# EAGLE design ab73287 (EAGLE 9.6.2)
Spring 2021 Spring break camp Jonathan Valvano and Daniel Valvano This PCB is meant as a starter file to implement labs associated with EE319K/EE319H For more information see http://users.ece.utexas.edu/~valvano/Volume1/ March 10, 2021
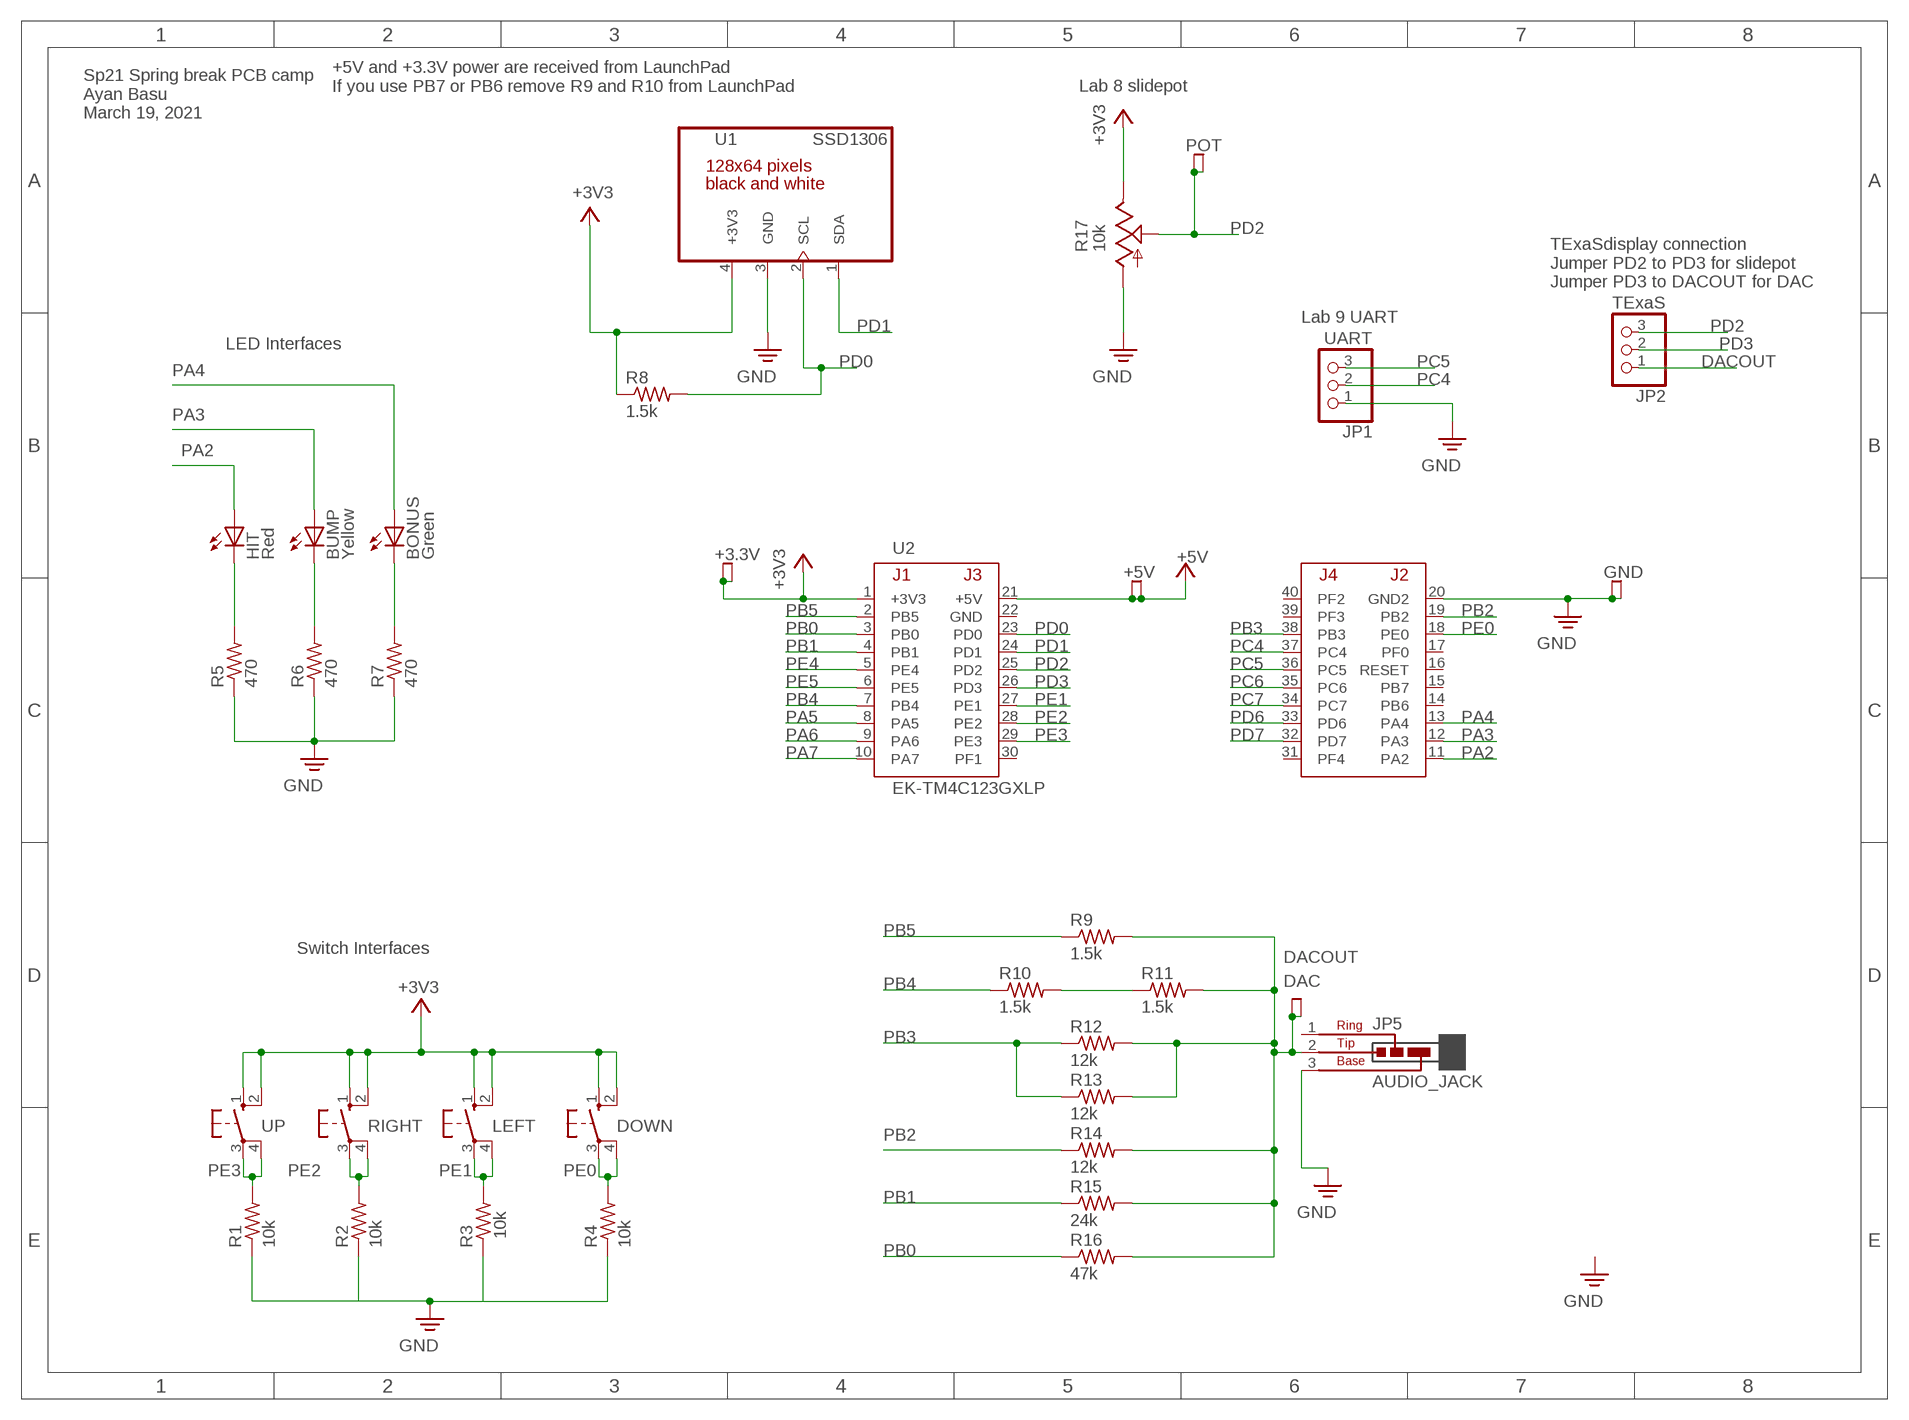
[diagram p0: schematic, sheet 1]

## Parts
+3.3V  TP2  [TP2]
+5V  TP2  [TP2]
BONUS  Green  LED5MM  [LED5MM]
BUMP  Yellow  LED5MM  [LED5MM]
DAC  TP2  [TP2]
DOWN  B3F-1052  [B3F-10XX]
GND  TP2  [TP2]
HIT  Red  LED5MM  [LED5MM]
JP1  UART  PINHD-1X3  [1X03]
JP2  TExaS  PINHD-1X3  [1X03]
JP5  AUDIO_JACK  [JACK]
LEFT  B3F-1052  [B3F-10XX]
POT  TP2  [TP2]
R1  10k  RESISTOR0204/7  [RES300MIL]
R2  10k  RESISTOR0204/7  [RES300MIL]
R3  10k  RESISTOR0204/7  [RES300MIL]
R4  10k  RESISTOR0204/7  [RES300MIL]
R5  470  RESISTOR0204/7  [RES300MIL]
R6  470  RESISTOR0204/7  [RES300MIL]
R7  470  RESISTOR0204/7  [RES300MIL]
R8  1.5k  RESISTOR0204/7  [RES300MIL]
R9  1.5k  RESISTOR0204/7  [RES300MIL]
R10  1.5k  RESISTOR0204/7  [RES300MIL]
R11  1.5k  RESISTOR0204/7  [RES300MIL]
R12  12k  RESISTOR0204/7  [RES300MIL]
R13  12k  RESISTOR0204/7  [RES300MIL]
R14  12k  RESISTOR0204/7  [RES300MIL]
R15  24k  RESISTOR0204/7  [RES300MIL]
R16  47k  RESISTOR0204/7  [RES300MIL]
R17  10k  POTENTIOMETERB25U  [B25U]
RIGHT  B3F-1052  [B3F-10XX]
U1  SSD1306  [SSD1306]
U2  EK-TM4C123GXLP  [TM4C123LAUNCHPAD]
UP  B3F-1052  [B3F-10XX]

## Nets
+3V3: +3.3V.MP1(TPB) +3.3V.MP(TPA) DOWN.1(S) DOWN.2(S1) LEFT.1(S) LEFT.2(S1) R8.1 R17.1(E) RIGHT.1(S) RIGHT.2(S1) U1.4(+3V3) U2.1(+3V3) UP.1(S) UP.2(S1)
+5V: +5V.MP1(TPB) +5V.MP(TPA) U2.21(+5V)
BIT4: R10.2 R11.1
DACOUT: DAC.MP1(TPB) DAC.MP(TPA) JP2.1 JP5.2(TIP) R9.2 R11.2 R12.2 R13.2 R14.2 R15.2 R16.2
GND: GND.MP1(TPB) GND.MP(TPA) JP1.1 JP5.3(BASE) R1.1 R2.1 R3.1 R4.1 R5.1 R6.1 R7.1 R17.3(A) U1.3(GND) U2.20(GND2)
GREEN: BONUS.K(C) R7.2
PA2: HIT.A U2.11(PA2)
PA3: BUMP.A U2.12(PA3)
PA4: BONUS.A U2.13(PA4)
PA5: U2.8(PA5)
PA6: U2.9(PA6)
PA7: U2.10(PA7)
PB0: R16.1 U2.3(PB0)
PB1: R15.1 U2.4(PB1)
PB2: R14.1 U2.19(PB2)
PB3: R12.1 R13.1 U2.38(PB3)
PB4: R10.1 U2.7(PB4)
PB5: R9.1 U2.2(PB5)
PC4: JP1.2 U2.37(PC4)
PC5: JP1.3 U2.36(PC5)
PC6: U2.35(PC6)
PC7: U2.34(PC7)
PD0: R8.2 U1.2(SCL) U2.23(PD0)
PD1: U1.1(SDA) U2.24(PD1)
PD2: JP2.3 POT.MP1(TPB) POT.MP(TPA) R17.2(S) U2.25(PD2)
PD3: JP2.2 U2.26(PD3)
PD6: U2.33(PD6)
PD7: U2.32(PD7)
PE0: DOWN.3(P) DOWN.4(P1) R4.2 U2.18(PE0)
PE1: LEFT.3(P) LEFT.4(P1) R3.2 U2.27(PE1)
PE2: R2.2 RIGHT.3(P) RIGHT.4(P1) U2.28(PE2)
PE3: R1.2 U2.29(PE3) UP.3(P) UP.4(P1)
PE4: U2.5(PE4)
PE5: U2.6(PE5)
RED: HIT.K(C) R5.2
YELLOW: BUMP.K(C) R6.2
Unconnected: JP5.1(RING) U2.14(PB6) U2.15(PB7) U2.16(RESET) U2.17(PF0) U2.22(GND) U2.30(PF1) U2.31(PF4) U2.39(PF3) U2.40(PF2)

## Notes on the sheet
- +5V and +3.3V power are received from LaunchPad
  If you use PB7 or PB6 remove R9 and R10 from LaunchPad
- Lab 8 slidepot
- Sp21 Spring break PCB camp
  Ayan Basu
  March 19, 2021
- TExaSdisplay connection
  Jumper PD2 to PD3 for slidepot
  Jumper PD3 to DACOUT for DAC
- Lab 9 UART
- LED Interfaces
- Switch Interfaces

## Library data of the parts
+3.3V +5V DAC GND POT = EE445L:TP2: Low-cost test point Made with two 0.8mm holes.
BONUS BUMP HIT = EE445L:LED: Avago Technologies LED Green 2mA 5mm diffused, HLMP-4740, Digikey 516-1327-ND Red 1.6V 1mA 5mm diffused, HLMP-D150, Digikey 516-1323-ND Yellow 2mA 5mm diffused, HLMP-4719, Digikey 516-1326-ND Orange 10mA 5mm diffused HLMP-D401, Digikey 516-1330-ND Blue 10mA 5mm diffused
DOWN LEFT RIGHT UP = EE445L:B3F-1052: OMRON SWITCH 1.1mm holes B3F tactile push button switch, Omron, B3F-1050 SW404-ND; MPN: B3F-1000; OC_FARNELL: 176432; OC_NEWARK: 36M3542
JP1 JP2 = EE445L:PINHD-1X3: PIN HEADER
JP5 = EE445L:AUDIO_JACK: Audio Jack Stereo Jack 3pin 3.5mm, CUI, SJ1-3553NG, CP1-3553NG-ND; OC_FARNELL: unknown; OC_NEWARK: unknown
R1-R16 = EE445L:RESISTOR: RESISTOR, American symbol
R17 = EE445L:POTENTIOMETER: POTENTIOMETER Warning There are many many sizes and shapes of potentiometers. Please verify both the wiring and the physical layout of your pots.
U1 = EE445L:SSD1306: Typo on OLED has a 0-ohm resistor selection that says "IIC ADDRESS SELECT 0x78 0x7A" should have said "IIC ADDRESS SELECT 0x3C 0x3D" search for I2C SSD1306 on Amazon.com https://www.amazon.com/gp/product/B0871KW7BD - VCC 3.3V power to OLED - GND ground - SCL I2C clock (add 1.5k resistor from SCL to 3.3V) - SDA I2C data * ----I2C0------ |-----I2C1 -----|-----I2C2 ------|------I2C3---- * ---------------- | ---------------- | ---------------- | ---------------- * SCL ---- PB2 | SCL --- PA6 | SCL ---- PE4 | SCL --- PD0 * SDA --- PB3 | SDA --- PA7 | SDA -- PE5 | SDA --- PD1
U2 = EE445L:EK-TM4C123GXL: Texas Instruments TM4C123 LaunchPad EK-TM4C123GXL www.ti.com/tool/ek-tm4c123gxl

## Board
Spring 2021 Spring break camp Jonathan Valvano and Daniel Valvano This PCB is meant as a starter file to implement labs associated with EE319K/EE319H For more information see http://users.ece.utexas.edu/~valvano/Volume1/ March 10, 2021
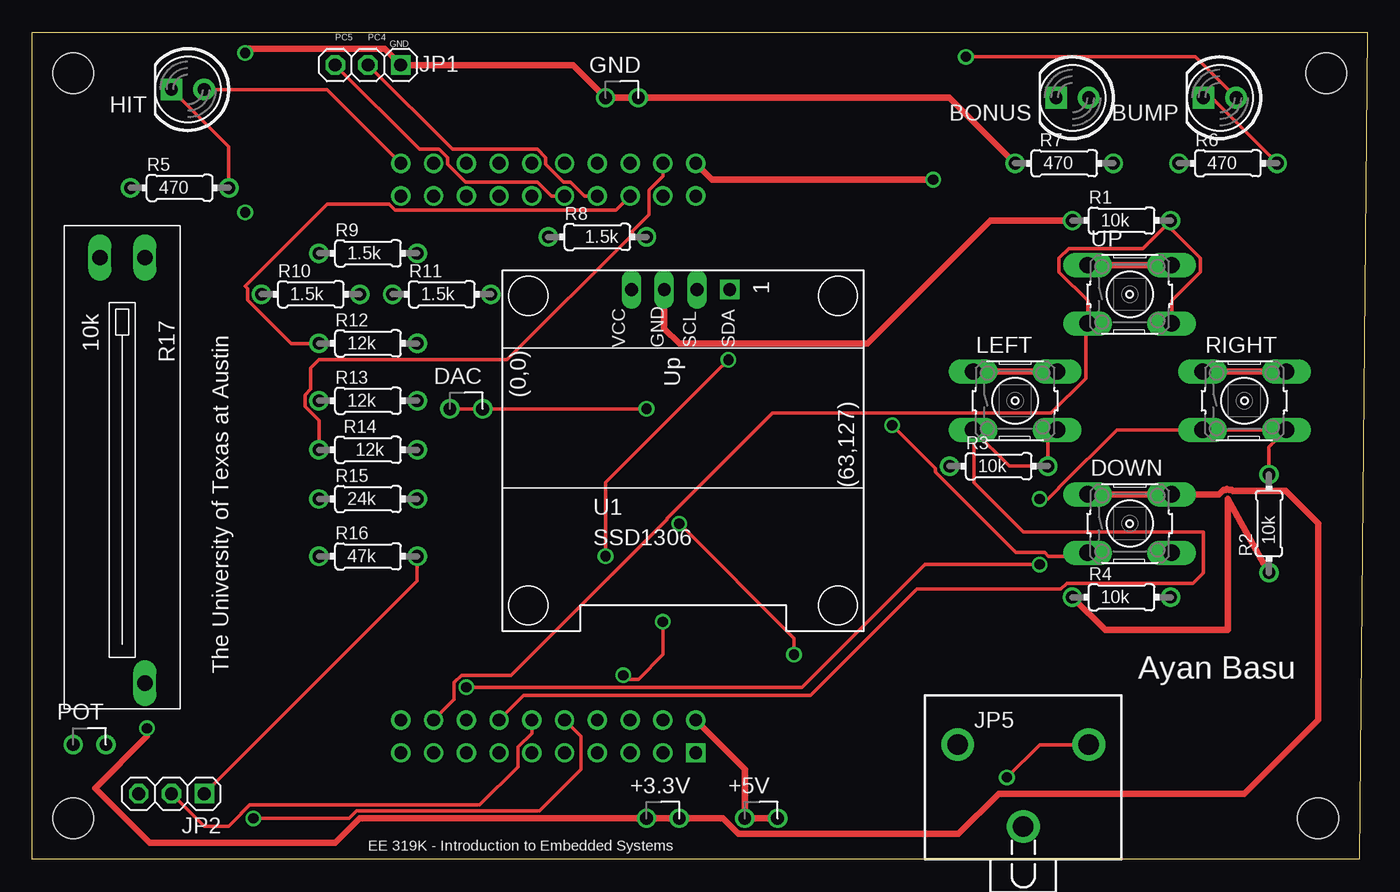
[diagram p1: board, top side]
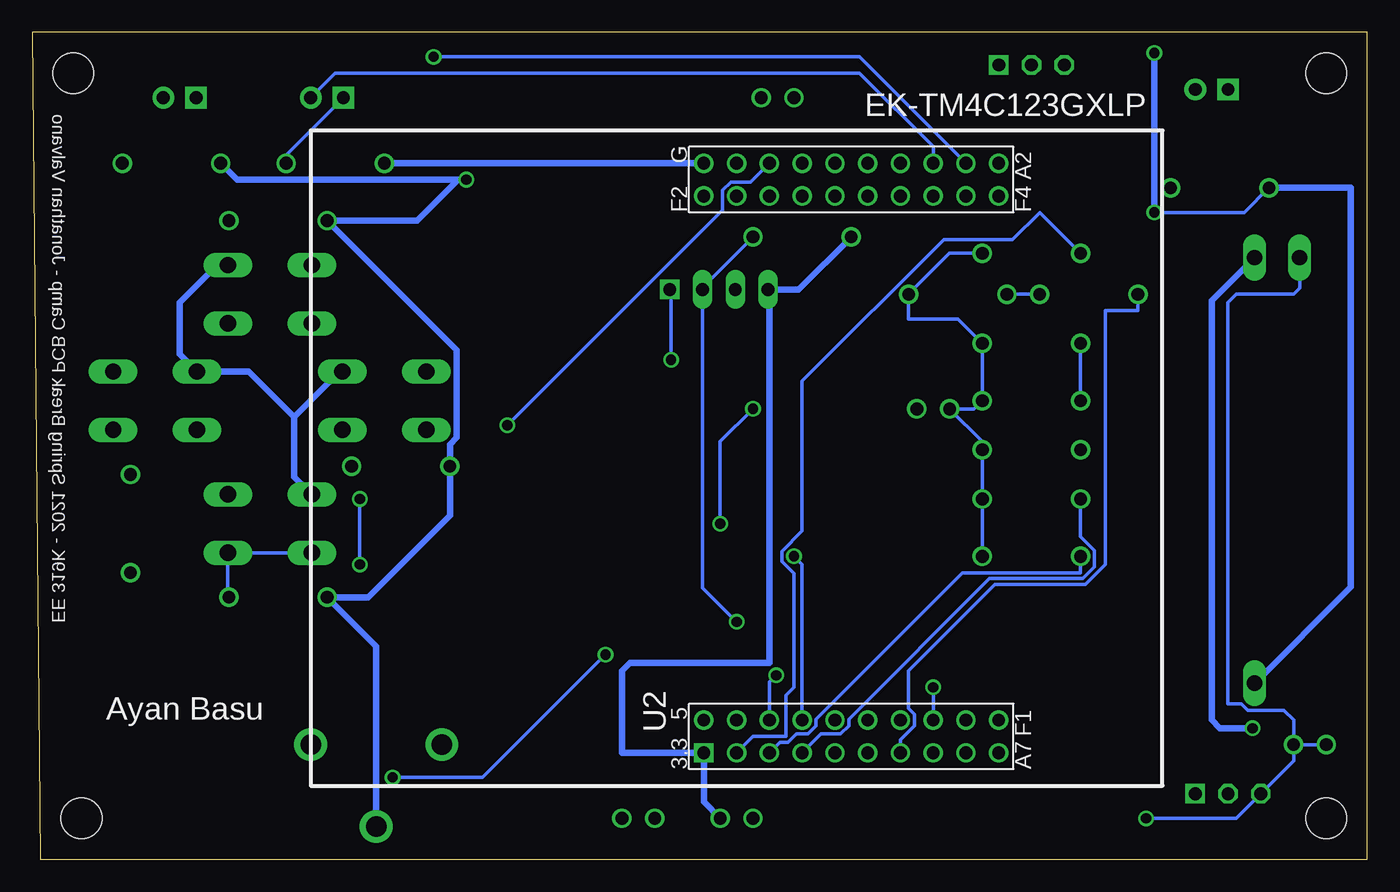
[diagram p2: board, bottom side, seen from below]

Size 103.5 x 64.14 mm. Coordinates in mm from the lower left corner, seen from the top.
Outline: 0,64.14 103.5,64.14 102.87,0 0,0 0,64.14
Copper layers (1*16): Top 0.035mm / dielectric 1.5mm / Bottom 0.035mm
Design rules "default *": minimum track width 10mil, minimum drill 0.8mm, track to track 8mil, track to pad 8mil, pad to pad 8mil, via to via 8mil, smd to smd 8mil, copper to edge 40mil, drill to drill 8mil, minimum pad ring 10mil, minimum via ring 8mil, stop-mask expansion 4mil, vias tented up to drill 0mil, thermal gap 10mil
Holes 3.17 mm at 3.17,60.96 3.17,3.17 99.69,3.17 100.33,60.96

### Footprints (pad centres in the part's own frame; a part is rotated, then mirrored left to right if it is on the bottom)
TP2 = drill 0.991: MP 0,0; MP1 2.54,0
LED5MM = drill 0.991 pad 1.676: A -1.27,0 | drill 0.991 pad 1.676 square: K 1.27,0
B3F-10XX = drill 1.27 long: 1 -3.251,2.261; 2 3.251,2.261; 3 -3.251,-2.261; 4 3.251,-2.261
1X03 = drill 1 square: 1 -2.54,0 | drill 1 octagon: 2 0,0; 3 2.54,0
JACK = drill 1.587 pad 2.54: 1 -5.08,2.54; 2 5.08,2.54; 3 0,-3.81
RES300MIL = drill 0.991: 1 -3.81,0; 2 3.81,0
B25U = drill 1.194 long: 1 -13,1.75; 2 -13,-1.75; 3 20,1.75
SSD1306 = drill 0.991 square: 1 16.61,24.5 | drill 0.991 long: 2 14.07,24.5; 3 11.53,24.5; 4 8.99,24.5
TM4C123LAUNCHPAD = drill 0.991 square: 1 -22.86,12.7 | drill 0.991: 2 -22.86,10.16; 3 -22.86,7.62; 4 -22.86,5.08; 5 -22.86,2.54; 6 -22.86,0; 7 -22.86,-2.54; 8 -22.86,-5.08; 9 -22.86,-7.62; 10 -22.86,-10.16; 11 22.86,-10.16; 12 22.86,-7.62; 13 22.86,-5.08; 14 22.86,-2.54; 15 22.86,0; 16 22.86,2.54; 17 22.86,5.08; 18 22.86,7.62; 19 22.86,10.16; 20 22.86,12.7; 21 -20.32,12.7; 22 -20.32,10.16; 23 -20.32,7.62; 24 -20.32,5.08; 25 -20.32,2.54; 26 -20.32,0; 27 -20.32,-2.54; 28 -20.32,-5.08; 29 -20.32,-7.62; 30 -20.32,-10.16; 31 20.32,-10.16; 32 20.32,-7.62; 33 20.32,-5.08; 34 20.32,-2.54; 35 20.32,0; 36 20.32,2.54; 37 20.32,5.08; 38 20.32,7.62; 39 20.32,10.16; 40 20.32,12.7

### Placement (x,y rotation side)
+3.3V  47.62,3.17 0 top
+5V  55.24,3.17 0 top
BONUS  80.64,59.05 180 top
BUMP  92.08,59.05 180 top
DAC  32.38,34.92 0 top
DOWN  85.09,26.04 0 top
GND  44.45,59.05 0 top
HIT  12.06,59.69 180 top
JP1  26.04,61.59 180 top
JP2  10.79,5.08 180 top
JP5  76.83,6.35 0 top
LEFT  76.2,35.56 0 top
POT  3.17,8.89 0 top
R1  84.45,49.53 0 top
R2  95.89,26.04 90 top
R3  74.93,30.48 0 top
R4  84.45,20.32 0 top
R5  11.43,52.07 0 top
R6  92.71,53.98 0 top
R7  80.01,53.98 0 top
R8  43.81,48.26 0 top
R9  26.04,46.99 0 top
R10  21.59,43.81 0 top
R11  31.75,43.81 0 top
R12  26.04,40.01 0 top
R13  26.04,35.56 0 top
R14  26.04,31.75 0 top
R15  26.04,27.94 0 top
R16  26.04,23.5 0 top
R17  6.99,33.66 270 top
RIGHT  93.98,35.56 0 top
U1  37.47,19.68 0 top
U2  38.73,31.11 90 bottom
UP  85.09,43.81 0 top

### Tracks (layer width: path | path; a pad name or v marks a point on that pad's centre or on a via)
+3V3  (via drill 0.8)
  Top 0.508: DOWN.1 DOWN.2 91.98,28.3 92.34,28.65 92.53,28.65 92.62,28.7 92.81,28.65 93,28.65 93.08,28.57 93.19,28.54 97.19,28.54 99.69,26.04 99.69,10.79 93.98,5.08 74.93,5.08 71.82,1.97 54.74,1.97 53.54,3.17 +3.3V.MP1 +3.3V.MP 25.4,3.17 23.5,1.27 9.12,1.27 4.88,5.51 8.89,9.53 v8.89,10.16 | LEFT.1 LEFT.2 | UP.1 UP.2 | RIGHT.1 RIGHT.2
  Bottom 0.508: +3.3V.MP1 51.44,4.45 U2.1 57.78,8.26 57.78,14.61 57.15,15.24 46.35,15.24 46.35,44.09 U1.4 44.08,44.19 R8.1 | DOWN.1 83.19,29.64 83.19,34.29 | LEFT.2 79.65,37.82 83.19,34.29 | 83.19,34.29 86.72,37.82 RIGHT.1 92.08,39.17 92.08,43.18 88.9,46.35 88.62,46.35 UP.2 | R17.1 12.06,43.33 12.06,10.79 11.43,10.16 v8.89,10.16
+5V
  Top 0.508: U2.21 55.24,6.99 +5V.MP +5V.MP1
BIT4
  Bottom 0.254: R11.1 R10.2
DACOUT  (via drill 0.8)
  Top 0.254: DAC.MP DAC.MP1 v47.62,34.92 | v50.16,26.04 59.05,17.14 v59.05,15.88 | v75.56,6.35 78.11,8.89 JP5.2 | R16.2 29.84,21.59 JP2.1
  Bottom 0.254: R16.2 R15.2 R14.2 29.84,32.38 DAC.MP 30.48,34.92 R13.2 R12.2 31.75,41.91 35.56,41.91 R11.2 32.38,46.99 R9.2 | v47.62,34.92 50.16,32.38 v50.16,26.04 | v59.05,15.88 68.58,6.35 v75.56,6.35
GND  (via drill 0.8)
  Top 0.508: v69.85,52.7 52.7,52.7 U2.20 | R7.1 71.12,59.05 GND.MP1 GND.MP 41.91,61.59 JP1.1 27.3,62.87 16.86,62.87 v16.51,62.52 | R4.1 83.19,17.78 92.71,17.78 92.71,27.94 R2.1 | U1.3 48.99,41.17 50.16,40.01 64.77,40.01 74.3,49.53 R1.1
  Bottom 0.254: R5.1 9.53,50.16 v16.51,50.16
  Bottom 0.508: JP5.3 76.83,16.51 R4.1 77.47,20.32 71.12,26.67 R3.1 71.12,32.18 70.59,32.72 70.59,39.47 R1.1 73.66,49.53 70.48,52.7 v69.85,52.7 87.63,52.7 R6.1 | U2.20 R7.1 | v16.51,62.52 v16.51,50.16 | R5.1 1.27,52.07 1.27,21.12 R17.3
GREEN
  Bottom 0.254: BONUS.K 83.82,54.61 R7.2
PA2
  Top 0.254: HIT.A 22.86,59.69 U2.11
PA3  (via drill 0.8)
  Top 0.254: BUMP.A 90.17,62.23 v72.39,62.23
  Bottom 0.254: v72.39,62.23 39.37,62.23 U2.12
PA4
  Bottom 0.254: BONUS.A 80.01,60.96 39.37,60.96 33.66,55.24 U2.13
PB0
  Bottom 0.254: U2.3 45.54,9.07 44.9,9.07 44.25,9.72 43.37,9.72 42.74,10.35 42.74,10.86 31.37,22.23 22.23,22.23 R16.1
PB1
  Bottom 0.254: U2.4 42.35,9.72 40.83,9.72 40.2,10.35 40.2,10.86 29.29,21.77 22.04,21.77 21.14,22.66 21.14,23.94 22.23,25.02 R15.1
PB2
  Top 0.254: R14.1 22.23,34.03 21.14,35.11 21.14,36.01 21.59,36.45 21.59,38.1 22.23,38.73 36.83,38.73 46.55,48.45 46.55,48.71 47.82,49.98 47.82,51.88 48.9,52.96 U2.19
PB3
  Top 0.254: U2.38 45.28,50.35 28.13,50.35 27.68,50.8 22.86,50.8 16.51,44.45 16.7,44.26 16.7,43.37 20.06,40.01 R12.1
  Bottom 0.254: R12.1 R13.1
PB4
  Bottom 0.254: U2.7 36.2,9.27 35.12,10.35 35.12,11.24 35.56,11.69 35.56,14.61 28.85,21.31 21.85,21.31 20.69,22.47 20.69,22.49 20.32,22.86 20.32,42.55 17.78,42.55 R10.1
PB5
  Bottom 0.254: U2.2 47.62,9.53 45.09,9.53 45.09,12.7 44.45,13.34 44.45,22.18 45.38,23.11 45.38,23.88 43.81,25.45 43.81,37.09 32.83,48.07 27.5,48.07 25.4,50.16 R9.1
PC4
  Top 0.254: JP1.2 32.58,55.05 39.18,55.05 39.81,54.42 39.81,53.91 41.21,52.51 41.72,52.51 42.8,51.44 U2.37
PC5
  Top 0.254: JP1.3 30.04,55.05 31.56,55.05 32.19,54.42 32.19,53.91 33.59,52.51 39.18,52.51 40.26,51.44 U2.36
PD0  (via drill 0.8)
  Top 0.254: v48.9,18.41 48.9,15.88 46.99,13.97 46.12,13.97 v45.83,14.27
  Bottom 0.254: R8.2 51.53,44.35 U1.2 51.53,21.05 v48.9,18.41 | v45.83,14.27 46.35,13.74 U2.23
PD1  (via drill 0.8)
  Top 0.254: v44.45,23.5 44.45,29.21 v53.98,38.73
  Bottom 0.254: U2.24 43.81,22.86 v44.45,23.5 | v53.98,38.73 53.98,44.09 U1.1
PD2  (via drill 0.8)
  Top 0.254: v17.14,3.17 24.57,3.17 25.16,3.76 39.32,3.76 42.55,6.99 42.55,9.53 U2.25
  Bottom 0.254: POT.MP1 5.71,7.62 JP2.3 10.16,3.17 v17.14,3.17 | POT.MP1 POT.MP | POT.MP1 5.71,10.79 6.45,11.53 9.24,11.53 9.77,12.06 10.79,12.06 10.79,43.18 10.16,43.81 5.71,43.81 5.24,44.3 R17.2
PD3
  Top 0.254: JP2.2 13.34,2.54 15.24,2.54 16.21,3.51 16.21,3.56 16.87,4.22 34.7,4.22 37.66,7.18 37.66,8.7 38.73,9.78 U2.26
PE0  (via drill 0.8)
  Top 0.254: v66.67,33.66 70.04,30.29 70.04,30.03 76.28,23.79 78.49,23.79 78.79,23.5 81.56,23.5 DOWN.3
  Bottom 0.254: U2.18 47.82,52.51 49.34,52.51 49.97,51.88 49.97,50.35 v66.67,33.66 | R4.2 88.34,20.4 DOWN.4 DOWN.3
PE1
  Top 0.254: LEFT.4 78.74,32.59 R3.2 75.77,30.48 LEFT.3 73.03,33.22 73.03,29.21 76.83,25.4 90.81,25.4 90.81,22.23 89.98,21.4 80.2,21.4 79.75,20.95 68.58,20.95 60.33,12.7 38.1,12.7 U2.27
PE2  (via drill 0.8)
  Top 0.254: R2.2 95.89,31.95 RIGHT.4 RIGHT.3 84.08,33.3 79.6,28.83 79.6,28.8 78.74,27.94 v78.11,27.94 | v78.11,22.86 69.22,22.86 59.69,13.34 v33.66,13.34
  Bottom 0.254: v78.11,27.94 v78.11,22.86 | v33.66,13.34 U2.28
PE3
  Top 0.254: UP.4 88.34,43.31 90.58,45.54 90.58,46.61 88.27,48.92 R1.2 86.09,47.36 80.36,47.36 79.6,46.61 79.6,45.54 81.84,43.31 UP.3 81.69,41.4 81.69,37.29 78.99,34.59 57.4,34.59 49.23,26.42 49.23,26.37 37.13,14.27 33.27,14.27 32.72,13.72 32.72,12.4 U2.29
RED
  Top 0.254: HIT.K 15.24,55.24 R5.2
YELLOW
  Top 0.254: BUMP.K 91.44,59.05 R6.2

### Text on the board
tPlace: PC5 | PC4 | GND | The University of Texas at Austin | Ayan Basu | EE 319K - Introduction to Embedded Systems
bPlace: EE 319K - 2021 Spring Break PCB Camp - Jonathan Valvano | Ayan Basu